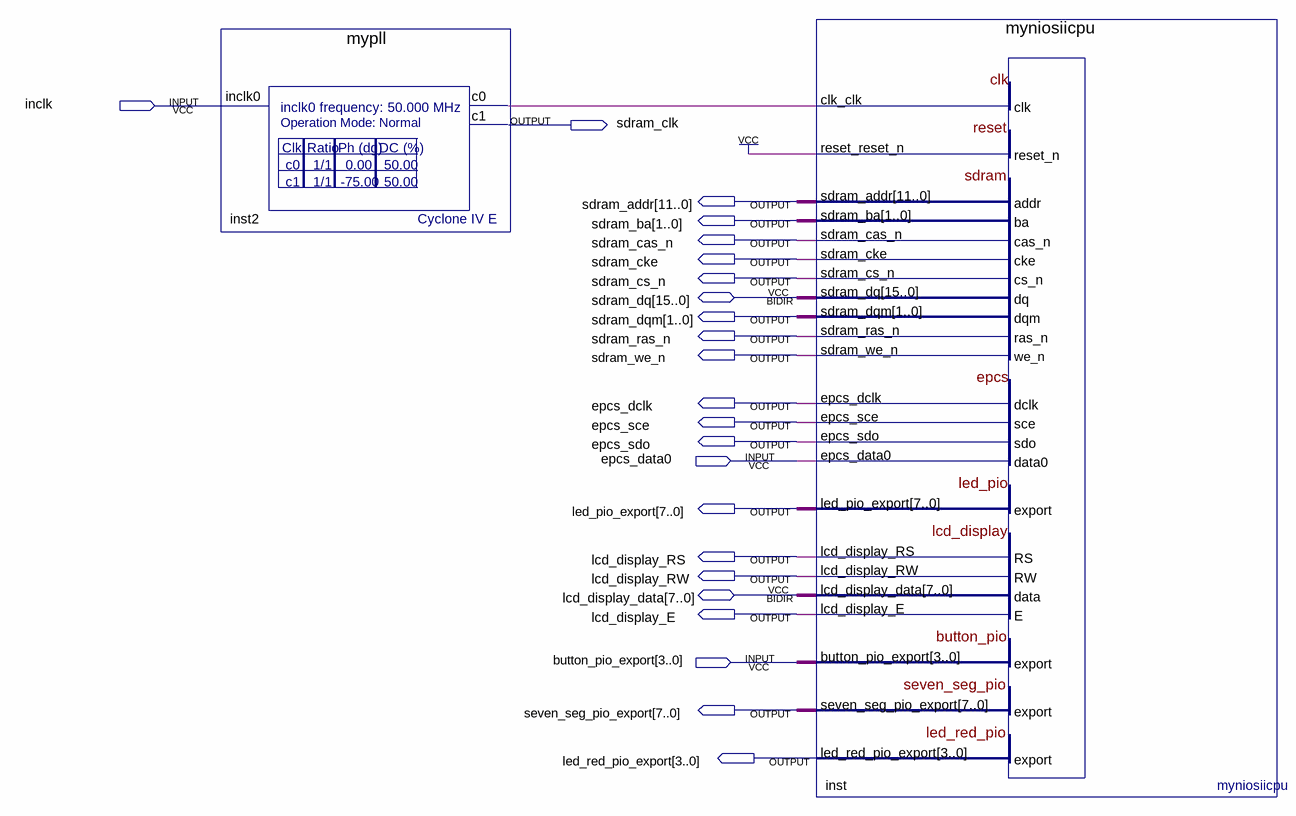
[diagram p0: schematic sheet]
// Quartus schematic de2_115.bdf as structural Verilog: 2 symbols, 23 pins
module de2_115 (
  input  inclk,
  input  epcs_data0,
  input  [3:0] button_pio_export,
  inout  [15:0] sdram_dq,
  inout  [7:0] lcd_display_data,
  output sdram_clk,
  output [11:0] sdram_addr,
  output [1:0] sdram_ba,
  output sdram_cas_n,
  output sdram_cke,
  output sdram_cs_n,
  output [1:0] sdram_dqm,
  output sdram_ras_n,
  output sdram_we_n,
  output epcs_dclk,
  output epcs_sce,
  output epcs_sdo,
  output [7:0] led_pio_export,
  output lcd_display_RS,
  output lcd_display_RW,
  output lcd_display_E,
  output [7:0] seven_seg_pio_export,
  output [3:0] led_red_pio_export
);

  wire inst2_c0;

  mypll inst2 (.inclk0(inclk), .c0(inst2_c0), .c1(sdram_clk));
  myniosiicpu inst (
    .clk_clk(inst2_c0), .reset_reset_n(1'b1), .epcs_data0(epcs_data0), .button_pio_export(button_pio_export),
    .sdram_addr(sdram_addr), .sdram_ba(sdram_ba), .sdram_cas_n(sdram_cas_n), .sdram_cke(sdram_cke),
    .sdram_cs_n(sdram_cs_n), .sdram_dqm(sdram_dqm), .sdram_ras_n(sdram_ras_n), .sdram_we_n(sdram_we_n),
    .epcs_dclk(epcs_dclk), .epcs_sce(epcs_sce), .epcs_sdo(epcs_sdo), .led_pio_export(led_pio_export),
    .lcd_display_RS(lcd_display_RS), .lcd_display_RW(lcd_display_RW), .lcd_display_E(lcd_display_E),
    .seven_seg_pio_export(seven_seg_pio_export), .led_red_pio_export(led_red_pio_export),
    .sdram_dq(sdram_dq), .lcd_display_data(lcd_display_data));
endmodule
